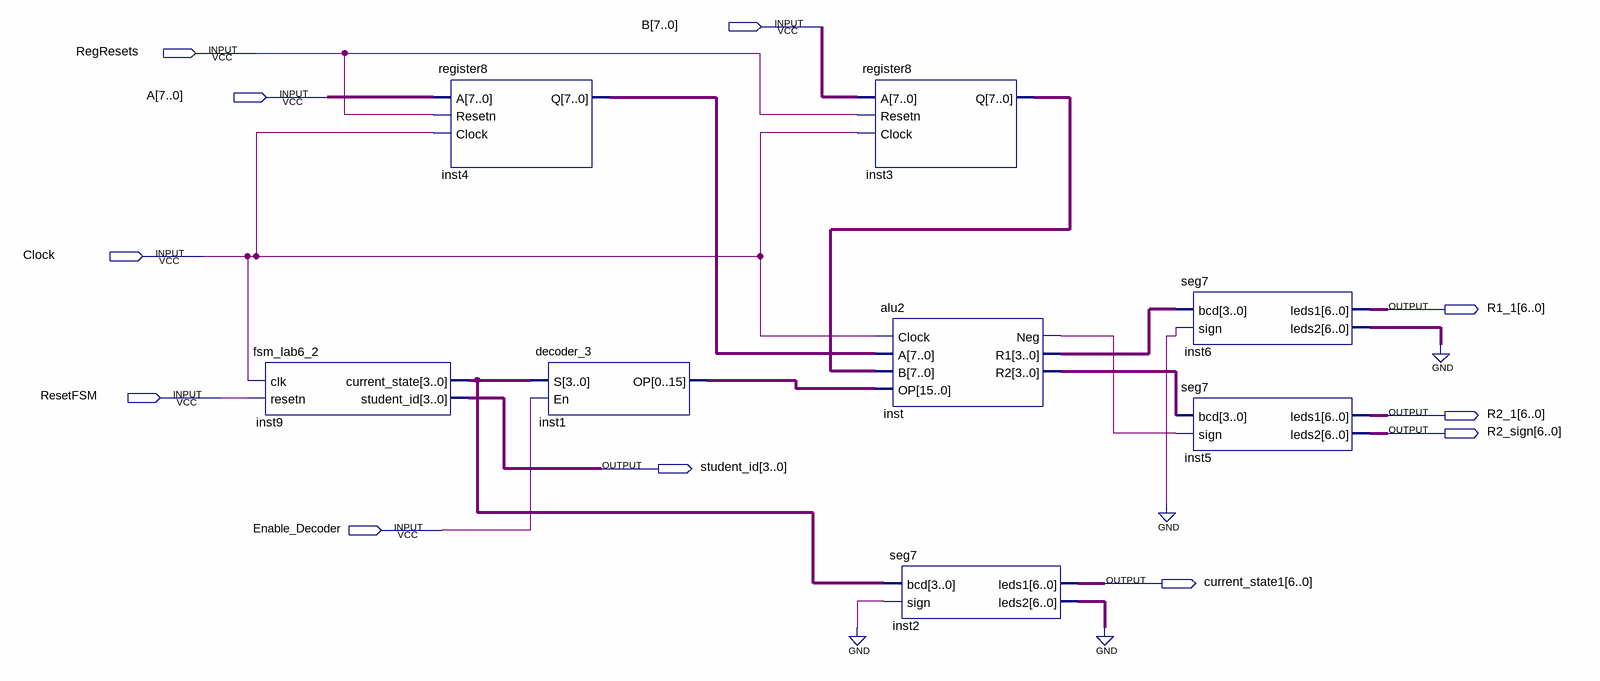
[diagram p0: schematic sheet]
// Quartus schematic lab6_2.bdf as structural Verilog: 8 symbols, 11 pins
module lab6_2 (
  input  [7:0] B,
  input  RegResets,
  input  [7:0] A,
  input  Clock,
  input  ResetFSM,
  input  Enable_Decoder,
  output [6:0] R1_1,
  output [6:0] R2_1,
  output [6:0] R2_sign,
  output [3:0] student_id,
  output [6:0] current_state1
);

  wire inst_neg;
  wire [3:0] inst9_current_state, inst_r1, inst_r2;
  wire [6:0] inst2_leds2, inst6_leds2;
  wire [7:0] inst3_q, inst4_q;
  wire [15:0] inst1_op;

  fsm_lab6_2 inst9 (.clk(Clock), .resetn(ResetFSM), .current_state(inst9_current_state), .student_id(student_id));
  register8 inst4 (.A(A), .Resetn(RegResets), .Clock(Clock), .Q(inst4_q));
  decoder_3 inst1 (.S(inst9_current_state), .En(Enable_Decoder), .OP(inst1_op));
  register8 inst3 (.A(B), .Resetn(RegResets), .Clock(Clock), .Q(inst3_q));
  alu2 inst (.Clock(Clock), .A(inst4_q), .B(inst3_q), .OP(inst1_op), .Neg(inst_neg), .R1(inst_r1), .R2(inst_r2));
  seg7 inst2 (.bcd(inst9_current_state), .sign(1'b0), .leds1(current_state1), .leds2(inst2_leds2));
  seg7 inst6 (.bcd(inst_r1), .sign(1'b0), .leds1(R1_1), .leds2(inst6_leds2));
  seg7 inst5 (.bcd(inst_r2), .sign(inst_neg), .leds1(R2_1), .leds2(R2_sign));
  // also tied to GND on the sheet: {inst6_leds2[0], inst6_leds2[1], inst6_leds2[2], inst6_leds2[3], inst6_leds2[4], inst6_leds2[5], inst6_leds2[6], inst2_leds2[0], inst2_leds2[1], inst2_leds2[2], inst2_leds2[3], inst2_leds2[4], inst2_leds2[5], inst2_leds2[6]}
endmodule
